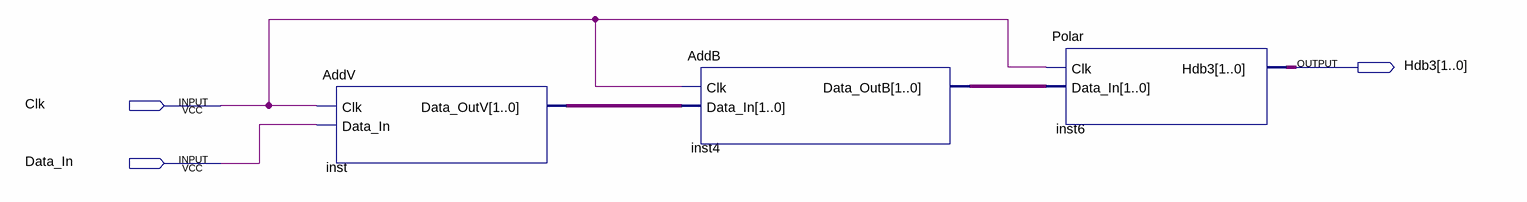
[diagram p0: schematic sheet]
// Quartus schematic Hdb3.bdf as structural Verilog: 3 symbols, 3 pins
module Hdb3 (
  input  Clk,
  input  Data_In,
  output [1:0] Hdb3
);

  wire [1:0] inst4_data_outb, inst_data_outv;

  AddV inst (.Clk(Clk), .Data_In(Data_In), .Data_OutV(inst_data_outv));
  AddB inst4 (.Clk(Clk), .Data_In(inst_data_outv), .Data_OutB(inst4_data_outb));
  Polar inst6 (.Clk(Clk), .Data_In(inst4_data_outb), .Hdb3(Hdb3));
endmodule
